# Altium schematic sheet IOSection.SchDoc
size A
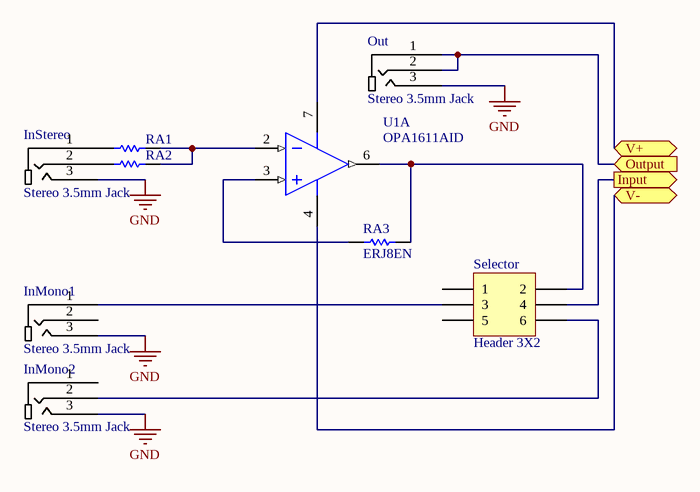
[diagram p0: IOSection.SchDoc]

## Parts
InMono1  Stereo 3.5mm Jack  [3.5mm Audio Jack]
InMono2  Stereo 3.5mm Jack  [3.5mm Audio Jack]
InStereo  Stereo 3.5mm Jack  [3.5mm Audio Jack]
Out  Stereo 3.5mm Jack  [3.5mm Audio Jack]
RA1  ERJ8EN  [8-1206]  (value not drawn)
RA2  ERJ8EN  [8-1206]  (value not drawn)
RA3  ERJ8EN  [8-1206]
Selector  Header 3X2  [HDR2X3]
U1  OPA1611AID  [TI-D8_N]  (part A of 2)

## Ports
Input (out), Output (in), V+, V-

## Nets
GND: InMono1.3 InMono2.3 InStereo.3 Out.3
Input: Selector.4 ; port Input
Output: Out.1 Out.2 ; port Output
V+: U1.7(V+) ; port V+
V-: U1.4(V-) ; port V-
NetInMono1_1: InMono1.1 Selector.3
NetInMono2_2: InMono2.2 Selector.6
NetInStereo_1: InStereo.1 RA1.1
NetInStereo_2: InStereo.2 RA2.1
NetRA1_2: RA1.2 RA2.2 U1.2(IN-)
NetRA3_1: RA3.1 U1.3(IN+)
NetRA3_2: RA3.2 Selector.2 U1.6(OUT)

Not connected (* = marked no-connect by the designer): InMono1 2; InMono2 1; Selector 1 5

## Library data of the parts
RA1-RA3 = ERJ8EN: Precision Thick Film Chip Resistor, 10 Ohm to 2.2M Ohm Range, 1% Tolerance, 1206 Size, 0.125 W; Published: 17-Dec-2003; LatestRevisionDate: 19-Mar-2004; LatestRevisionNote: Silkscreen size reduced.; PackageDocument: Mar-2003; PackageReference: 8-1206; Publisher: Altium Limited; Code_IPC: 3216 [1206]; ComponentLink1Description: Manufacturer Link; ComponentLink1URL: http://www.panasonic.com/industrial/components/resistive_products.htm; ComponentLink2Description: Datasheet; ComponentLink2URL: http://www.panasonic.com/industrial/components/pdf/AOA0000CE2.pdf
Selector = Header 3X2: Header, 3-Pin, Dual row; LatestRevisionDate: 17-Jul-2002; LatestRevisionNote: Re-released for DXP Platform.; Publisher: Altium Limited
U1 = OPA1611AID: 1.1 nV/rtHz Noise, Low Power, Precision Operational Amplifier, 4.5 to 36 V, -40 to 85 degC, 8-pin SOIC (D8), Green (RoHS & no Sb/Br); Manufacturer: Texas Instruments; GBW(Typ)(MHz): 40; Iq per channel(Max)(mA): 4.5; Number of Channels: 1; SubFamily: Audio Operational Amplifier; Vmax(V): 36; Vn at Flatband(Typ)(nV/rtHz): 1.1; DatasheetVersion: SBOS450B; PackageVersion: 4040047-3/M, 06/2011; PackageReference: D8; PackageDescription: 8-Pin Plastic Small Outline, Body 4.9 x 3.9 mm, Pitch 1.27 mm; Supplier 1: Digi-Key; Supplier Part Number 1: 296-24958-5-ND; Supplier 2: Farnell; Supplier Part Number 2: 1754264; Supplier 3: Newark; Supplier Part Number 3: 50R7815; Supplier 4: Mouser; Supplier Part Number 4: 595-OPA1611AID; Eco-Plan: Green (RoHS & no Sb/Br); Vmin(V): 4.5; Mounting Technology: Surface Mount; Code_JEDEC: MS-012; PartNumber: OPA1611AID; ComponentLink1Description: Manufacturer URL; ComponentLink1URL: http://www.ti.com/; ComponentLink2Description: Datasheet; ComponentLink2URL: http://www.ti.com/general/docs/lit/getliterature.tsp?genericPartNumber=OPA1611&fileType=pdf; ComponentLink3Description: Package Specification; ComponentLink3URL: http://www.ti.com/litv/pdf/msoi002j